# Altium schematic sheet Top.SchDoc
size A4; Organization: Technokrat; Address1: 3 Minna Close; Address2: Belrose; Address3: NSW 2085; Address4: Australia; SheetNumber: 1; SheetTotal: 10
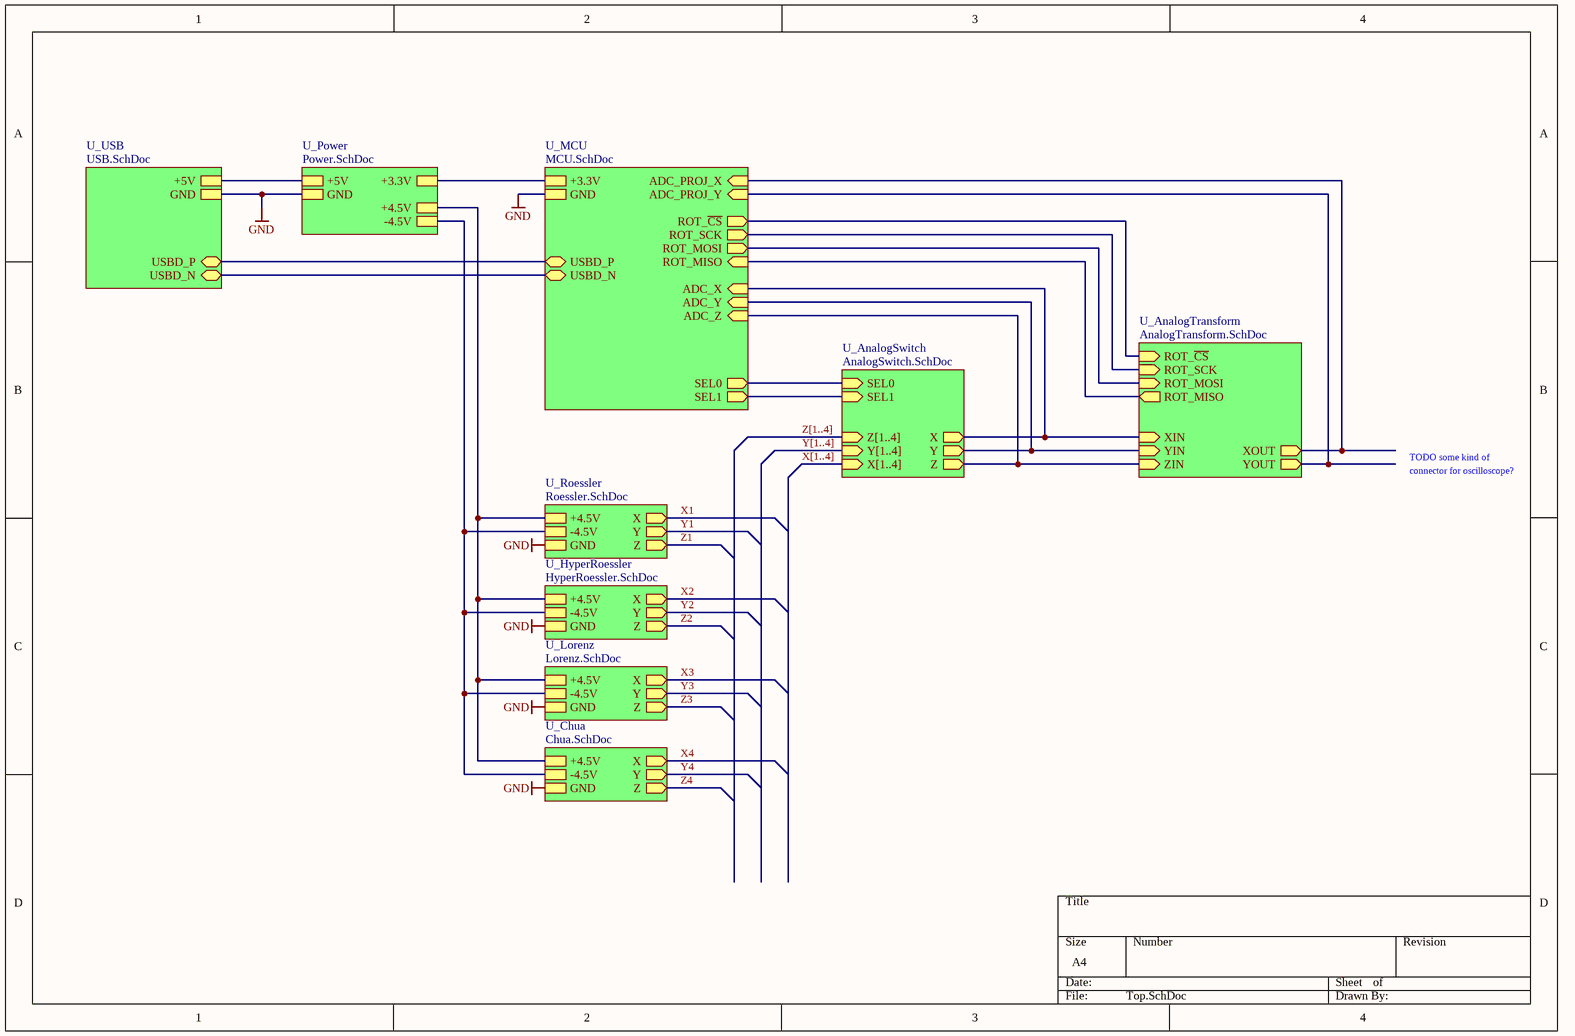
[diagram p0: Top.SchDoc]

## Sub-sheets
U_AnalogSwitch = AnalogSwitch.SchDoc: SEL0 (in), SEL1 (in), X (out), Y (out), Z (out), X[1..4] (in), Y[1..4] (in), Z[1..4] (in)
U_AnalogTransform = AnalogTransform.SchDoc: XIN (in), YIN (in), ZIN (in), XOUT (out), YOUT (out), ROT_MISO (out), ROT_MOSI (in), ROT_SCK (in), ROT_~{CS} (in)
U_Chua = Chua.SchDoc: X (out), Y (out), Z (out), +4.5V, -4.5V, GND
U_HyperRoessler = HyperRoessler.SchDoc: X (out), Y (out), Z (out), GND, -4.5V, +4.5V
U_Lorenz = Lorenz.SchDoc: X (out), Y (out), Z (out), GND, -4.5V, +4.5V
U_MCU = MCU.SchDoc: +3.3V, GND, SEL0 (out), SEL1 (out), ADC_PROJ_Y (in), ADC_PROJ_X (in), USBD_P (bidir), USBD_N (bidir), ADC_X (in), ADC_Y (in), ADC_Z (in), ROT_~{CS} (out), ROT_SCK (out), ROT_MOSI (out), ROT_MISO (in)
U_Power = Power.SchDoc: GND, +5V, +3.3V, +4.5V, -4.5V
U_Roessler = Roessler.SchDoc: X (out), Y (out), Z (out), +4.5V, -4.5V, GND
U_USB = USB.SchDoc: GND, +5V, USBD_N (bidir), USBD_P (bidir)

## Nets
GND: sheet U_Chua/GND, sheet U_Power/GND, sheet U_Roessler/GND, sheet U_MCU/GND, sheet U_USB/GND, sheet U_HyperRoessler/GND, sheet U_Lorenz/GND
X1: sheet U_Roessler/X
X2: sheet U_HyperRoessler/X
X3: sheet U_Lorenz/X
X4: sheet U_Chua/X
Y1: sheet U_Roessler/Y
Y2: sheet U_HyperRoessler/Y
Y3: sheet U_Lorenz/Y
Y4: sheet U_Chua/Y
Z1: sheet U_Roessler/Z
Z2: sheet U_HyperRoessler/Z
Z3: sheet U_Lorenz/Z
Z4: sheet U_Chua/Z
(unnamed): sheet U_Chua/+4.5V, sheet U_Power/+4.5V, sheet U_Roessler/+4.5V, sheet U_HyperRoessler/+4.5V, sheet U_Lorenz/+4.5V
(unnamed): sheet U_Chua/-4.5V, sheet U_Power/-4.5V, sheet U_Roessler/-4.5V, sheet U_HyperRoessler/-4.5V, sheet U_Lorenz/-4.5V
(unnamed): sheet U_Power/+5V, sheet U_USB/+5V
(unnamed): sheet U_Power/+3.3V, sheet U_MCU/+3.3V
(unnamed): sheet U_AnalogSwitch/SEL0, sheet U_MCU/SEL0
(unnamed): sheet U_AnalogSwitch/SEL1, sheet U_MCU/SEL1
(unnamed): sheet U_AnalogSwitch/X, sheet U_MCU/ADC_X, sheet U_AnalogTransform/XIN
(unnamed): sheet U_AnalogSwitch/Y, sheet U_MCU/ADC_Y, sheet U_AnalogTransform/YIN
(unnamed): sheet U_AnalogSwitch/Z, sheet U_MCU/ADC_Z, sheet U_AnalogTransform/ZIN
(unnamed): sheet U_MCU/ADC_PROJ_Y, sheet U_AnalogTransform/YOUT
(unnamed): sheet U_MCU/ADC_PROJ_X, sheet U_AnalogTransform/XOUT
(unnamed): sheet U_MCU/USBD_P, sheet U_USB/USBD_P
(unnamed): sheet U_MCU/USBD_N, sheet U_USB/USBD_N
(unnamed): sheet U_MCU/ROT_~{CS}, sheet U_AnalogTransform/ROT_~{CS}
(unnamed): sheet U_MCU/ROT_SCK, sheet U_AnalogTransform/ROT_SCK
(unnamed): sheet U_MCU/ROT_MOSI, sheet U_AnalogTransform/ROT_MOSI
(unnamed): sheet U_MCU/ROT_MISO, sheet U_AnalogTransform/ROT_MISO

## Buses and harness runs
bus X[1..4] = sheet U_AnalogSwitch/X[1..4]
bus Y[1..4] = sheet U_AnalogSwitch/Y[1..4]
bus Z[1..4] = sheet U_AnalogSwitch/Z[1..4]

## Notes on the sheet
- TODO some kind of
- connector for oscilloscope?
- Rev:
- /
- File: